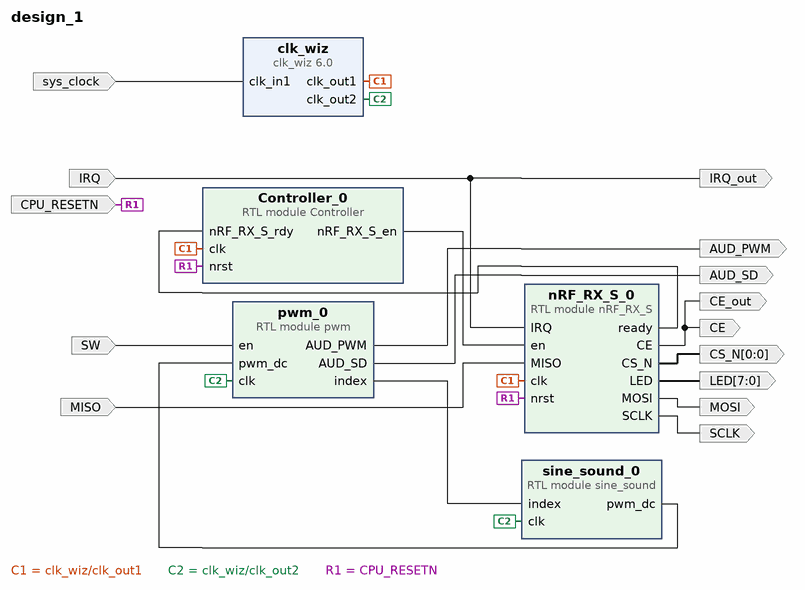
[diagram p0: block diagram of the top level]
# Vivado block design design_1, xc7a100tcsg324-1, Vivado 2020.2
create_bd_design design_1

create_bd_port -dir O AUD_PWM
create_bd_port -dir O AUD_SD
create_bd_port -dir I -type rst CPU_RESETN
create_bd_port -dir O CE
create_bd_port -dir O -from 0 -to 0 CS_N
create_bd_port -dir I -type intr IRQ
create_bd_port -dir O -from 7 -to 0 LED
create_bd_port -dir I MISO
create_bd_port -dir O MOSI
create_bd_port -dir O SCLK
create_bd_port -dir O IRQ_out
create_bd_port -dir O CE_out
create_bd_port -dir I -type clk sys_clock
set_property -dict {CONFIG.FREQ_HZ 100000000 CONFIG.PHASE 0.000} [get_bd_ports sys_clock]
create_bd_port -dir I SW

create_bd_cell -type ip -vlnv xilinx.com:ip:clk_wiz:6.0 clk_wiz
set_property -dict [list \
  CONFIG.CLKOUT1_JITTER 146.380 \
  CONFIG.CLKOUT1_PHASE_ERROR 119.384 \
  CONFIG.CLKOUT2_JITTER 223.282 \
  CONFIG.CLKOUT2_PHASE_ERROR 119.384 \
  CONFIG.CLKOUT2_REQUESTED_OUT_FREQ 12.288 \
  CONFIG.CLKOUT2_USED true \
  CONFIG.CLK_IN1_BOARD_INTERFACE sys_clock \
  CONFIG.MMCM_CLKFBOUT_MULT_F 7.250 \
  CONFIG.MMCM_CLKOUT0_DIVIDE_F 7.250 \
  CONFIG.MMCM_CLKOUT1_DIVIDE 59 \
  CONFIG.NUM_OUT_CLKS 2 \
  CONFIG.USE_BOARD_FLOW true \
  CONFIG.USE_LOCKED true \
  CONFIG.USE_RESET false \
] [get_bd_cells clk_wiz]
create_bd_cell -type module -reference nRF_RX_S nRF_RX_S_0
create_bd_cell -type module -reference pwm pwm_0
create_bd_cell -type module -reference sine_sound sine_sound_0
create_bd_cell -type module -reference Controller Controller_0

# ---- connections ----

connect_bd_net [get_bd_pins clk_wiz/clk_out1] [get_bd_pins nRF_RX_S_0/clk] [get_bd_pins Controller_0/clk]
connect_bd_net [get_bd_pins clk_wiz/clk_out2] [get_bd_pins pwm_0/clk] [get_bd_pins sine_sound_0/clk]
connect_bd_net [get_bd_pins sine_sound_0/pwm_dc] [get_bd_pins pwm_0/pwm_dc]
connect_bd_net [get_bd_pins pwm_0/index] [get_bd_pins sine_sound_0/index]
connect_bd_net [get_bd_pins pwm_0/AUD_PWM] [get_bd_ports AUD_PWM]
connect_bd_net [get_bd_pins pwm_0/AUD_SD] [get_bd_ports AUD_SD]
connect_bd_net [get_bd_pins Controller_0/nRF_RX_S_en] [get_bd_pins nRF_RX_S_0/en]
connect_bd_net [get_bd_ports CPU_RESETN] [get_bd_pins nRF_RX_S_0/nrst] [get_bd_pins Controller_0/nrst]
connect_bd_net [get_bd_pins nRF_RX_S_0/CE] [get_bd_ports CE] [get_bd_ports CE_out]
connect_bd_net [get_bd_pins nRF_RX_S_0/CS_N] [get_bd_ports CS_N]
connect_bd_net -net IRQ_0_1 [get_bd_ports IRQ] [get_bd_ports IRQ_out] [get_bd_pins nRF_RX_S_0/IRQ]
connect_bd_net [get_bd_pins nRF_RX_S_0/LED] [get_bd_ports LED]
connect_bd_net -net MISO_0_1 [get_bd_ports MISO] [get_bd_pins nRF_RX_S_0/MISO]
connect_bd_net [get_bd_pins nRF_RX_S_0/MOSI] [get_bd_ports MOSI]
connect_bd_net [get_bd_pins nRF_RX_S_0/SCLK] [get_bd_ports SCLK]
connect_bd_net [get_bd_pins nRF_RX_S_0/ready] [get_bd_pins Controller_0/nRF_RX_S_rdy]
connect_bd_net [get_bd_ports sys_clock] [get_bd_pins clk_wiz/clk_in1]
connect_bd_net [get_bd_ports SW] [get_bd_pins pwm_0/en]

validate_bd_design
save_bd_design
